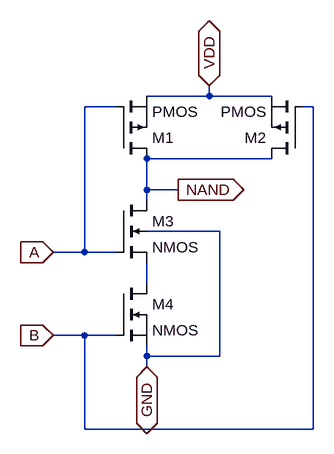
[diagram p0: schematic nand.asc]
nand.asc, the LTspice schematic file:
Version 4
SHEET 1 880 680
WIRE 240 32 240 16
WIRE 240 32 144 32
WIRE 336 32 240 32
WIRE 96 48 48 48
WIRE 400 48 384 48
WIRE 336 128 144 128
WIRE 144 176 144 128
WIRE 192 176 144 176
WIRE 144 192 144 176
WIRE 256 240 144 240
WIRE 48 272 48 48
WIRE 48 272 0 272
WIRE 96 272 48 272
WIRE 144 320 144 288
WIRE 48 400 0 400
WIRE 96 400 48 400
WIRE 144 432 144 416
WIRE 256 432 256 240
WIRE 256 432 144 432
WIRE 144 448 144 432
WIRE 48 544 48 400
WIRE 400 544 400 48
WIRE 400 544 48 544
FLAG 240 16 VDD
IOPIN 240 16 BiDir
FLAG 144 448 GND
IOPIN 144 448 BiDir
FLAG 0 272 A
IOPIN 0 272 In
FLAG 0 400 B
IOPIN 0 400 In
FLAG 192 176 NAND
IOPIN 192 176 Out
SYMBOL pmos 96 128 M180
SYMATTR InstName M1
SYMBOL pmos 384 128 R180
SYMATTR InstName M2
SYMBOL nmos4 96 192 R0
SYMATTR InstName M3
SYMBOL nmos 96 320 R0
SYMATTR InstName M4

The netlist it stands for:
* nand.asc
M1 NAND A VDD VDD PMOS
M2 NAND B VDD VDD PMOS
M3 NAND A N001 GND NMOS
M4 N001 B GND GND NMOS
.model NMOS NMOS
.model PMOS PMOS
.lib standard.mos
.backanno
.end